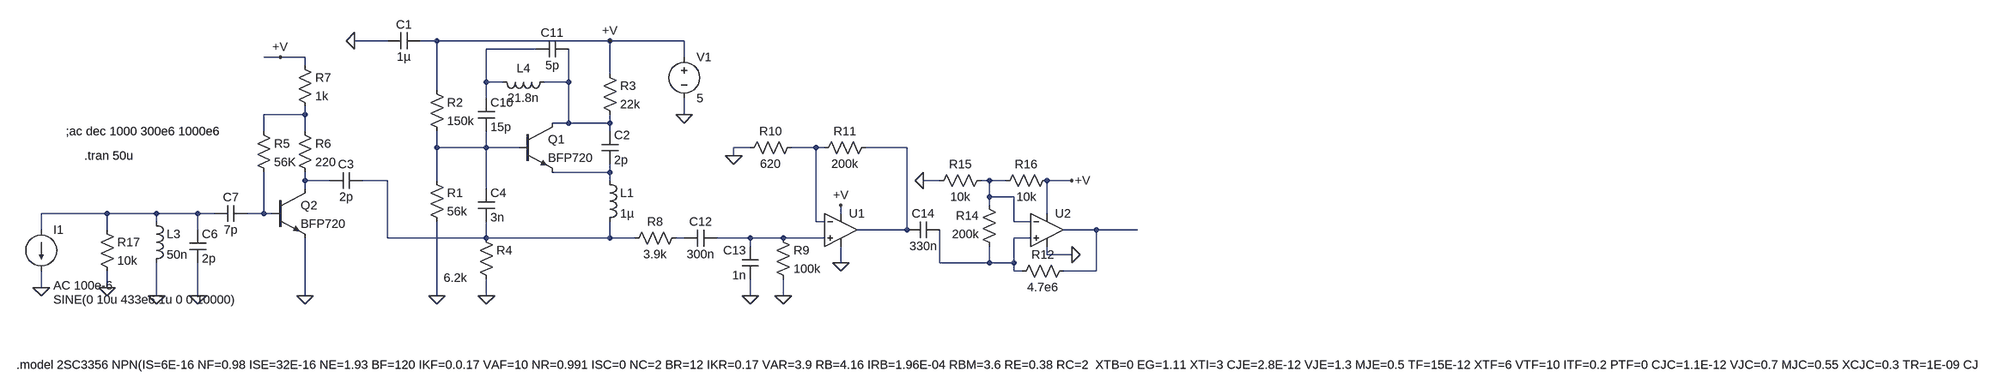
[diagram p0: schematic XY_MK_5V.asc]
XY_MK_5V.asc, the LTspice schematic file:
Version 4
SHEET 1 2984 680
WIRE -1632 -192 -1696 -192
WIRE -1536 -192 -1568 -192
WIRE -1200 -192 -1536 -192
WIRE -1056 -192 -1200 -192
WIRE -1344 -176 -1440 -176
WIRE -1840 -160 -1872 -160
WIRE -1792 -160 -1840 -160
WIRE -1056 -160 -1056 -192
WIRE -1792 -144 -1792 -160
WIRE -1200 -128 -1200 -192
WIRE -1440 -112 -1440 -176
WIRE -1408 -112 -1440 -112
WIRE -1280 -112 -1280 -176
WIRE -1280 -112 -1328 -112
WIRE -1536 -96 -1536 -192
WIRE -1440 -80 -1440 -112
WIRE -1792 -48 -1792 -64
WIRE -1792 -48 -1872 -48
WIRE -1056 -48 -1056 -80
WIRE -1280 -32 -1280 -112
WIRE -1280 -32 -1312 -32
WIRE -1200 -32 -1200 -48
WIRE -1200 -32 -1280 -32
WIRE -1872 -16 -1872 -48
WIRE -1792 -16 -1792 -48
WIRE -1200 -16 -1200 -32
WIRE -1536 16 -1536 -16
WIRE -1440 16 -1440 -16
WIRE -1440 16 -1536 16
WIRE -1376 16 -1440 16
WIRE -928 16 -960 16
WIRE -800 16 -848 16
WIRE -784 16 -800 16
WIRE -624 16 -704 16
WIRE -960 32 -960 16
WIRE -1200 64 -1200 48
WIRE -1200 64 -1312 64
WIRE -1792 80 -1792 64
WIRE -1744 80 -1792 80
WIRE -1632 80 -1680 80
WIRE -1536 80 -1536 16
WIRE -1200 80 -1200 64
WIRE -560 80 -592 80
WIRE -464 80 -480 80
WIRE -432 80 -464 80
WIRE -304 80 -352 80
WIRE -1792 96 -1792 80
WIRE -1440 96 -1440 16
WIRE -464 112 -464 80
WIRE -416 112 -464 112
WIRE -464 128 -464 112
WIRE -2176 144 -2304 144
WIRE -2080 144 -2176 144
WIRE -2000 144 -2080 144
WIRE -1968 144 -2000 144
WIRE -1872 144 -1872 64
WIRE -1872 144 -1904 144
WIRE -1856 144 -1872 144
WIRE -752 144 -752 128
WIRE -352 144 -352 80
WIRE -2080 160 -2080 144
WIRE -800 160 -800 16
WIRE -784 160 -800 160
WIRE -416 160 -416 112
WIRE -384 160 -416 160
WIRE -2304 176 -2304 144
WIRE -2176 176 -2176 144
WIRE -2000 176 -2000 144
WIRE -624 176 -624 16
WIRE -624 176 -720 176
WIRE -256 176 -320 176
WIRE -176 176 -256 176
WIRE -1632 192 -1632 80
WIRE -1440 192 -1440 160
WIRE -1440 192 -1632 192
WIRE -1200 192 -1200 160
WIRE -1200 192 -1440 192
WIRE -1152 192 -1200 192
WIRE -1056 192 -1072 192
WIRE -928 192 -992 192
WIRE -864 192 -928 192
WIRE -784 192 -864 192
WIRE -384 192 -416 192
WIRE -928 208 -928 192
WIRE -352 224 -352 208
WIRE -304 224 -352 224
WIRE -752 240 -752 208
WIRE -560 240 -560 176
WIRE -464 240 -464 208
WIRE -464 240 -560 240
WIRE -416 240 -416 192
WIRE -416 240 -464 240
WIRE -416 256 -416 240
WIRE -400 256 -416 256
WIRE -256 256 -256 176
WIRE -256 256 -320 256
WIRE -2304 288 -2304 256
WIRE -2176 288 -2176 256
WIRE -2080 304 -2080 240
WIRE -2000 304 -2000 240
WIRE -1792 304 -1792 192
WIRE -1536 304 -1536 160
WIRE -1440 304 -1440 272
WIRE -928 304 -928 272
WIRE -864 304 -864 272
FLAG -1536 304 0
FLAG -1200 -192 +V
FLAG -1440 304 0
FLAG -1056 -48 0
FLAG -2304 288 0
FLAG -1792 304 0
FLAG -2000 304 0
FLAG -2080 304 0
FLAG -1840 -160 +V
FLAG -1696 -192 0
FLAG -928 304 0
FLAG -864 304 0
FLAG -960 32 0
FLAG -752 240 0
FLAG -752 128 +V
FLAG -592 80 0
FLAG -304 224 0
FLAG -304 80 +V
FLAG -2176 288 0
SYMBOL npn -1376 -32 R0
SYMATTR InstName Q1
SYMATTR Value BFP720
SYMBOL res -1552 64 R0
SYMATTR InstName R1
SYMATTR Value 56k
SYMBOL res -1552 -112 R0
SYMATTR InstName R2
SYMATTR Value 150k
SYMBOL cap -1568 -208 R90
WINDOW 0 0 32 VBottom 2
WINDOW 3 32 32 VTop 2
SYMATTR InstName C1
SYMATTR Value 1µ
SYMBOL res -1216 -144 R0
SYMATTR InstName R3
SYMATTR Value 22k
SYMBOL cap -1216 -16 R0
SYMATTR InstName C2
SYMATTR Value 2p
SYMBOL ind -1216 64 R0
SYMATTR InstName L1
SYMATTR Value 1µ
SYMBOL res -1456 176 R0
WINDOW 3 -67 93 Left 2
SYMATTR InstName R4
SYMATTR Value 6.2k
SYMBOL voltage -1056 -176 R0
WINDOW 123 0 0 Left 2
WINDOW 39 0 0 Left 2
SYMATTR InstName V1
SYMATTR Value 5
SYMBOL current -2304 176 R0
WINDOW 3 24 136 Left 2
WINDOW 123 24 108 Left 2
WINDOW 39 0 0 Left 2
SYMATTR InstName I1
SYMATTR Value SINE(0 10u 433e6 1u 0 0 10000)
SYMATTR Value2 AC 100e-6
SYMBOL cap -1680 64 R90
WINDOW 0 0 32 VBottom 2
WINDOW 3 32 32 VTop 2
SYMATTR InstName C3
SYMATTR Value 2p
SYMBOL cap -1456 96 R0
SYMATTR InstName C4
SYMATTR Value 3n
SYMBOL ind -2096 144 R0
SYMATTR InstName L3
SYMATTR Value 50n
SYMBOL cap -2016 176 R0
SYMATTR InstName C6
SYMATTR Value 2p
SYMBOL cap -1904 128 R90
WINDOW 0 0 32 VBottom 2
WINDOW 3 32 32 VTop 2
SYMATTR InstName C7
SYMATTR Value 7p
SYMBOL npn -1856 96 R0
SYMATTR InstName Q2
SYMATTR Value BFP720
SYMBOL res -1888 -32 R0
SYMATTR InstName R5
SYMATTR Value 56K
SYMBOL res -1808 -32 R0
SYMATTR InstName R6
SYMATTR Value 220
SYMBOL res -1808 -160 R0
SYMATTR InstName R7
SYMATTR Value 1k
SYMBOL ind -1312 -128 R90
WINDOW 0 5 56 VBottom 2
WINDOW 3 32 56 VTop 2
SYMATTR InstName L4
SYMATTR Value 21.8n
SYMBOL cap -1456 -80 R0
SYMATTR InstName C10
SYMATTR Value 15p
SYMBOL cap -1280 -192 R90
WINDOW 0 0 32 VBottom 2
WINDOW 3 32 32 VTop 2
SYMATTR InstName C11
SYMATTR Value 5p
SYMBOL res -1056 176 R90
WINDOW 0 0 56 VBottom 2
WINDOW 3 32 56 VTop 2
SYMATTR InstName R8
SYMATTR Value 3.9k
SYMBOL cap -992 176 R90
WINDOW 0 0 32 VBottom 2
WINDOW 3 32 32 VTop 2
SYMATTR InstName C12
SYMATTR Value 300n
SYMBOL cap -912 272 R180
WINDOW 0 24 56 Left 2
WINDOW 3 24 8 Left 2
SYMATTR InstName C13
SYMATTR Value 1n
SYMBOL res -880 176 R0
SYMATTR InstName R9
SYMATTR Value 100k
SYMBOL res -832 0 R90
WINDOW 0 0 56 VBottom 2
WINDOW 3 32 56 VTop 2
SYMATTR InstName R10
SYMATTR Value 620
SYMBOL res -688 0 R90
WINDOW 0 0 56 VBottom 2
WINDOW 3 32 56 VTop 2
SYMATTR InstName R11
SYMATTR Value 200k
SYMBOL res -304 240 R90
WINDOW 0 0 56 VBottom 2
WINDOW 3 32 56 VTop 2
SYMATTR InstName R12
SYMATTR Value 4.7e6
SYMBOL res -448 224 R180
WINDOW 0 36 76 Left 2
WINDOW 3 36 40 Left 2
SYMATTR InstName R14
SYMATTR Value 200k
SYMBOL res -576 96 R270
WINDOW 0 32 56 VTop 2
WINDOW 3 0 56 VBottom 2
SYMATTR InstName R15
SYMATTR Value 10k
SYMBOL res -448 96 R270
WINDOW 0 32 56 VTop 2
WINDOW 3 0 56 VBottom 2
SYMATTR InstName R16
SYMATTR Value 10k
SYMBOL cap -560 160 R90
WINDOW 0 0 32 VBottom 2
WINDOW 3 32 32 VTop 2
SYMATTR InstName C14
SYMATTR Value 330n
SYMBOL Opamps\\UniversalOpamp2 -752 176 R0
SYMATTR InstName U1
SYMBOL Opamps\\UniversalOpamp2 -352 176 R0
SYMATTR InstName U2
SYMBOL res -2192 160 R0
SYMATTR InstName R17
SYMATTR Value 10k
TEXT -2220 32 Left 2 !.tran 50u
TEXT -2256 -16 Left 2 !;ac dec 1000 300e6 1000e6
TEXT -2352 560 Left 2 !.model 2SC3356 NPN(IS=6E-16 NF=0.98 ISE=32E-16 NE=1.93 BF=120 IKF=0.0.17 VAF=10 NR=0.991 ISC=0 NC=2 BR=12 IKR=0.17 VAR=3.9 RB=4.16 IRB=1.96E-04 RBM=3.6 RE=0.38 RC=2  XTB=0 EG=1.11 XTI=3 CJE=2.8E-12 VJE=1.3 MJE=0.5 TF=15E-12 XTF=6 VTF=10 ITF=0.2 PTF=0 CJC=1.1E-12 VJC=0.7 MJC=0.55 XCJC=0.3 TR=1E-09 CJS=0 VJS=0.75 MJS=0 FC=0.5

The netlist it stands for:
* XY_MK_5V.asc
Q1 N002 N004 N007 0 BFP720
R1 N004 0 56k
R2 +V N004 150k
C1 +V 0 1µ
R3 +V N002 22k
C2 N002 N007 2p
L1 N007 N009 1µ
R4 N009 0 6.2k
V1 +V 0 5
I1 N011 0 SINE(0 10u 433e6 1u 0 0 10000) AC 100e-6
C3 N009 N008 2p
C4 N004 N009 3n
L3 N011 0 50n
C6 N011 0 2p
C7 N012 N011 7p
Q2 N008 N012 0 0 BFP720
R5 N003 N012 56K
R6 N003 N008 220
R7 +V N003 1k
L4 N002 N001 21.8n
C10 N001 N004 15p
C11 N002 N001 5p
R8 N014 N009 3.9k
C12 N015 N014 300n
C13 0 N015 1n
R9 N015 0 100k
R10 N005 0 620
R11 N006 N005 200k
R12 N013 N016 4.7e6
R14 N016 N010 200k
R15 0 N010 10k
R16 N010 +V 10k
C14 N016 N006 330n
XU1 N015 N005 +V 0 N006 level.2 Avol=1Meg GBW=10Meg Slew=10Meg ilimit=25m rail=0 Vos=0 phimargin=45 en=0 enk=0 in=0 ink=0 Rin=500Meg  ; pins IN+ IN- V+ V- OUT
XU2 N016 N010 +V 0 N013 level.2 Avol=1Meg GBW=10Meg Slew=10Meg ilimit=25m rail=0 Vos=0 phimargin=45 en=0 enk=0 in=0 ink=0 Rin=500Meg  ; pins IN+ IN- V+ V- OUT
R17 N011 0 10k
.model NPN NPN
.model PNP PNP
.lib standard.bjt
.tran 50u
;ac dec 1000 300e6 1000e6
.model 2SC3356 NPN(IS=6E-16 NF=0.98 ISE=32E-16 NE=1.93 BF=120 IKF=0.0.17 VAF=10 NR=0.991 ISC=0 NC=2 BR=12 IKR=0.17 VAR=3.9 RB=4.16 IRB=1.96E-04 RBM=3.6 RE=0.38 RC=2  XTB=0 EG=1.11 XTI=3 CJE=2.8E-12 VJE=1.3 MJE=0.5 TF=15E-12 XTF=6 VTF=10 ITF=0.2 PTF=0 CJC=1.1E-12 VJC=0.7 MJC=0.55 XCJC=0.3 TR=1E-09 CJS=0 VJS=0.75 MJS=0 FC=0.5
.lib UniversalOpamps2.sub
.backanno
.end